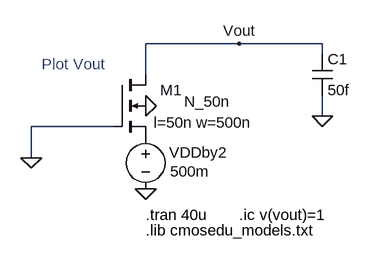
[diagram p0: schematic Fig14_5.asc]
Fig14_5.asc, the LTspice schematic file:
Version 4
SHEET 1 3172 680
WIRE 272 -128 272 -176
WIRE 400 -176 272 -176
WIRE 448 -256 448 -304
WIRE 592 -304 448 -304
WIRE 720 -304 592 -304
WIRE 720 -288 720 -304
WIRE 720 -192 720 -224
FLAG 448 -208 0
FLAG 448 -80 0
FLAG 272 -128 0
FLAG 720 -192 0
FLAG 592 -304 Vout
SYMBOL nmos4 400 -256 R0
WINDOW 0 104 24 Right 0
WINDOW 3 179 41 Right 0
WINDOW 123 213 74 Right 0
SYMATTR InstName M1
SYMATTR Value N_50n
SYMATTR Value2 l=50n w=500n
SYMBOL cap 704 -288 R0
SYMATTR InstName C1
SYMATTR Value 50f
SYMBOL voltage 448 -176 R0
WINDOW 0 36 40 Left 0
WINDOW 3 38 69 Left 0
SYMATTR InstName VDDby2
SYMATTR Value 500m
TEXT 448 -40 Left 0 !.tran 40u
TEXT 448 -16 Left 0 !.lib cmosedu_models.txt
TEXT 288 -272 Left 0 ;Plot Vout
TEXT 592 -40 Left 0 !.ic v(vout)=1

The netlist it stands for:
* Fig14_5.asc
M1 Vout 0 P001 0 N_50n l=50n w=500n
C1 Vout 0 50f
VDDby2 P001 0 500m
.model NMOS NMOS
.model PMOS PMOS
.lib standard.mos
.tran 40u
.lib cmosedu_models.txt
* Plot Vout
.ic v(vout)=1
.backanno
.end